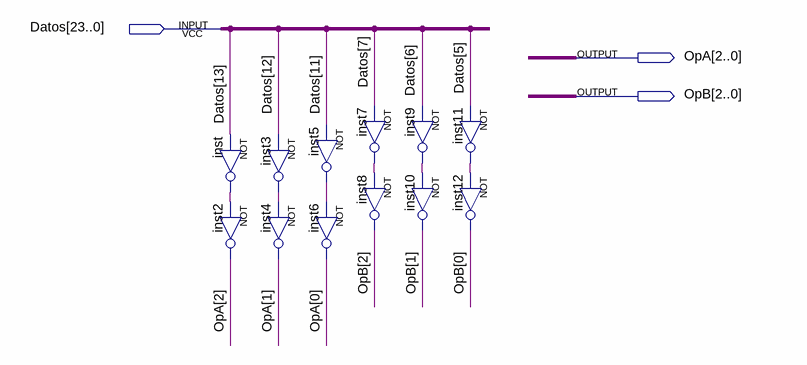
[diagram p0: schematic sheet]
// Quartus schematic BloqueRegistro.bdf as structural Verilog: 12 symbols, 3 pins
module BloqueRegistro (
  input  [23:0] Datos,
  output [2:0] OpA,
  output [2:0] OpB
);

  wire inst3_out, inst5_out, inst7_out, inst9_out, inst11_out, inst_out;

  not inst (inst_out, Datos[13]);
  not inst3 (inst3_out, Datos[12]);
  not inst2 (OpA[2], inst_out);
  not inst4 (OpA[1], inst3_out);
  not inst7 (inst7_out, Datos[7]);
  not inst5 (inst5_out, Datos[11]);
  not inst8 (OpB[2], inst7_out);
  not inst6 (OpA[0], inst5_out);
  not inst9 (inst9_out, Datos[6]);
  not inst10 (OpB[1], inst9_out);
  not inst11 (inst11_out, Datos[5]);
  not inst12 (OpB[0], inst11_out);
endmodule
